# Altium schematic sheet PGA.SCHDOC
size B
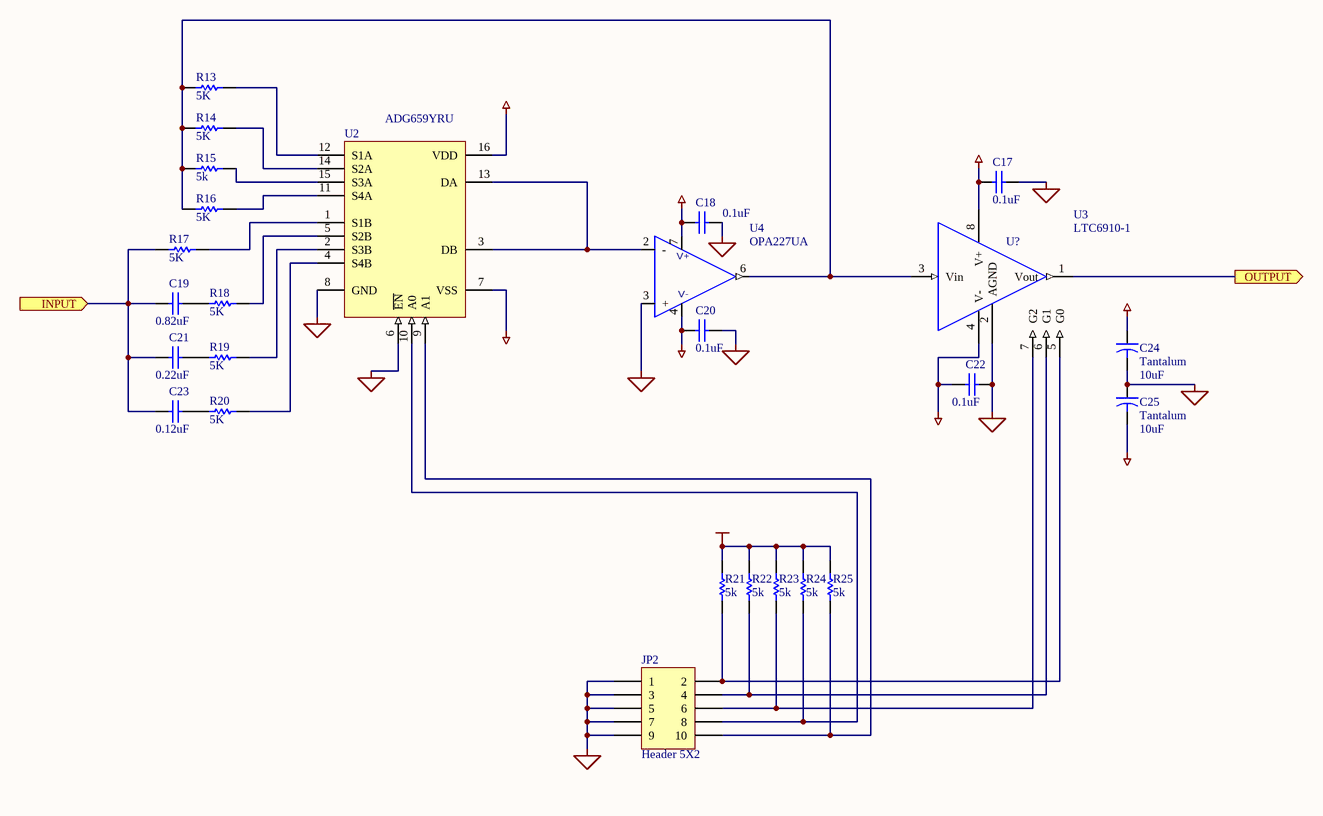
[diagram p0: PGA.SCHDOC]

## Parts
C17  value 0.1uF  [CC1608-0603]  (hidden comment: Cap)
C18  value 0.1uF  [CC1608-0603]  (hidden comment: Cap)
C19  value 0.82uF  [CC1608-0603]  (hidden comment: Cap)
C20  value 0.1uF  [CC1608-0603]  (hidden comment: Cap)
C21  value 0.22uF  [CC1608-0603]  (hidden comment: Cap)
C22  value 0.1uF  [CC1608-0603]  (hidden comment: Cap)
C23  value 0.12uF  [CC1608-0603]  (hidden comment: Cap)
C24  Tantalum  value 10uF  [TC3216-1206]
C25  Tantalum  value 10uF  [TC3216-1206]
JP2  Header 5X2  [HDR2X5]
R13  value 5K  [CC1608-0603]  (hidden comment: Res1)
R14  value 5K  [CC1608-0603]  (hidden comment: Res1)
R15  value 5k  [CC1608-0603]  (hidden comment: Res1)
R16  value 5K  [CC1608-0603]  (hidden comment: Res1)
R17  value 5K  [CC1608-0603]  (hidden comment: Res1)
R18  value 5K  [CC1608-0603]  (hidden comment: Res1)
R19  value 5K  [CC1608-0603]  (hidden comment: Res1)
R20  value 5K  [CC1608-0603]  (hidden comment: Res1)
R21  value 5k  [CC2012-0805]  (hidden comment: Res1)
R22  value 5k  [CC2012-0805]  (hidden comment: Res1)
R23  value 5k  [CC2012-0805]  (hidden comment: Res1)
R24  value 5k  [CC2012-0805]  (hidden comment: Res1)
R25  value 5k  [CC2012-0805]  (hidden comment: Res1)
U2  ADG659YRU  [TSSO5X6-G16]
U3  LTC6910-1  [TSOT-23-8]
U4  OPA227UA  [SO-G8/D5.1]

## Ports
INPUT (in), OUTPUT (out)

## Nets
AVDD: C17.1 C18.2 C24.1 R21.2 R22.2 R23.2 R24.2 R25.2 U2.16(VDD) U3.8(V+) U4.7(V+)
AVSS: C20.2 C22.2 C25.2 U2.7(VSS) U3.4(V-) U4.4(V-)
GND: C17.2 C18.1 C20.1 C22.1 C24.2 C25.1 JP2.1 JP2.3 JP2.5 JP2.7 JP2.9 U2.6(~{EN}) U2.8(GND) U3.2(AGND) U4.3(+)
INPUT: C19.2 C21.2 C23.2 R17.1 ; port INPUT
OUTPUT: U3.1(Vout) ; port OUTPUT
NetC19_1: C19.1 R18.1
NetC21_1: C21.1 R19.1
NetC23_1: C23.1 R20.1
NetJP2_2: JP2.2 R21.1 U3.5(G0)
NetJP2_4: JP2.4 R22.1 U3.6(G1)
NetJP2_6: JP2.6 R23.1 U3.7(G2)
NetJP2_8: JP2.8 R24.1 U2.10(A0)
NetJP2_10: JP2.10 R25.1 U2.9(A1)
NetR13_1: R13.1 R14.1 R15.1 R16.1 U3.3(Vin) U4.6(Vout)
NetR13_2: R13.2 U2.12(S1A)
NetR14_2: R14.2 U2.14(S2A)
NetR15_2: R15.2 U2.15(S3A)
NetR16_2: R16.2 U2.11(S4A)
NetR17_2: R17.2 U2.1(S1B)
NetR18_2: R18.2 U2.5(S2B)
NetR19_2: R19.2 U2.2(S3B)
NetR20_2: R20.2 U2.4(S4B)
NetU2_3: U2.3(DB) U2.13(DA) U4.2(-)

## Notes on the sheet
- (in symbol LTC6910-2) U?

## Library data of the parts
C17-C23 = Cap: Capacitor; Manufacturer: Generic Components; Class I: Passive; Published: 8-Jun-2000; Revision: July-2002: Re-released for DXP Platform.; Publisher: Altium Limited; Class II: Capacitor
C24 C25 = Cap2: Capacitor; Manufacturer: Generic Components; Class I: Passive; Published: 23-Sep-2002; Publisher: Altium Limited; Class II: Capacitor
JP2 = Header 5X2: Header, 5-Pin, Dual row; Manufacturer: Generic Components; Class I: Connector; Revision: July-2002: Re-released for DXP Platform.; Publisher: Altium Limited
R13-R25 = Res1: Resistor; Manufacturer: Generic Components; Class I: Passive; Published: 8-Jun-2000; Revision: July-2002: Re-released for DXP Platform.; Publisher: Altium Limited; Class II: Resistor
U2 = ADG659: ADG659 4:1 Differential +/- 5V Mux
U3 = LTC6910-2: LTI Digitally Controlled Programmabe Gain Amp